# EAGLE design CORS_Rear_Panel (EAGLE 9.6.2)
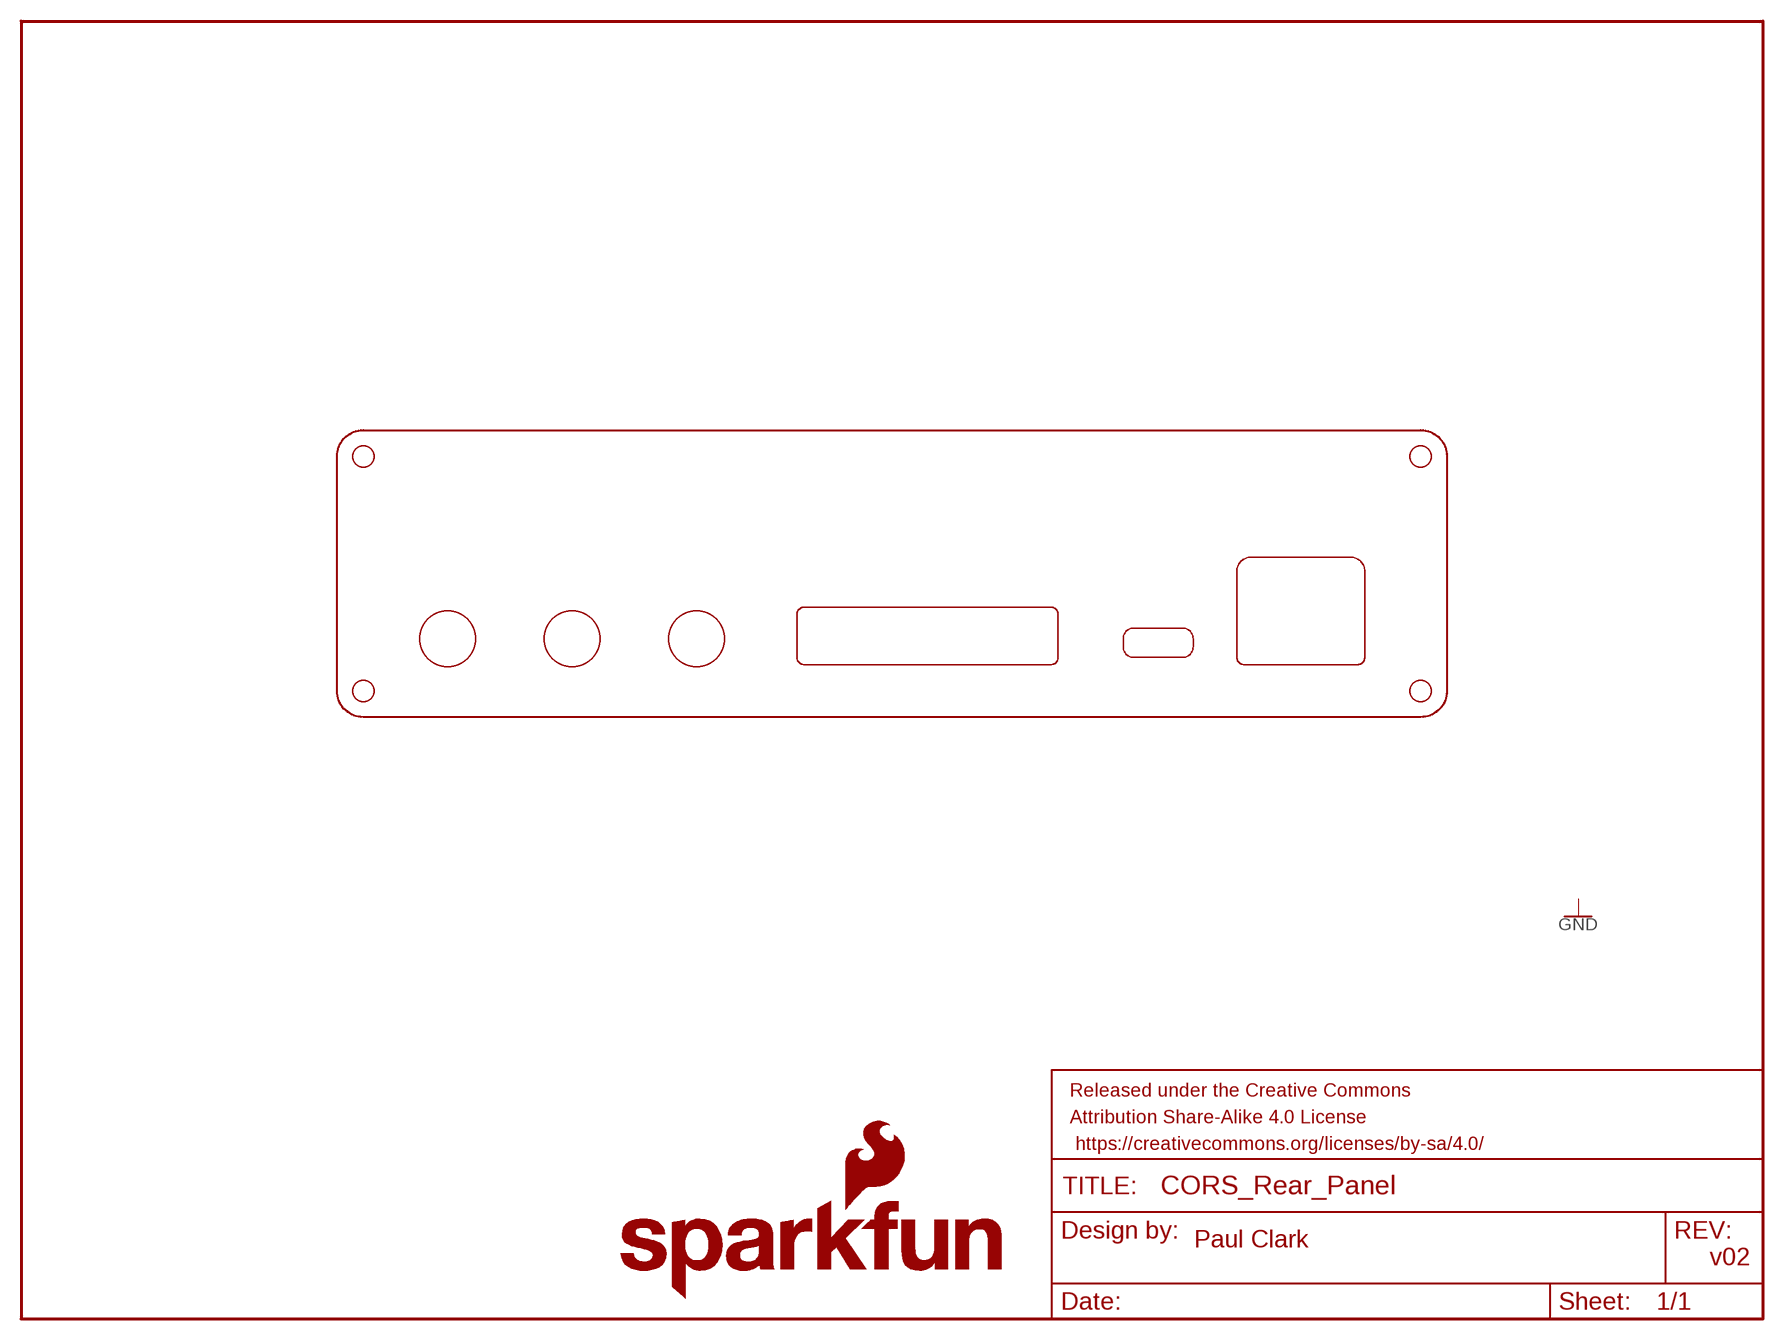
[diagram p0: schematic, sheet 1]

## Parts
ESP32_USB  USB-C  [USB-C]
FRAME1  FRAME-LETTER  [CREATIVE_COMMONS]
LOGO1  SFE_LOGO_NAME_FLAME.2_INCH  [SFE_LOGO_NAME_FLAME_.2]
PANEL_OUTLINE  PANEL_OUTLINE  [PANEL_OUTLINE]
U$8  3.5MM_CONNECTOR  [3.5MM_CONNECTOR]
U$13  SMA  [SMA]
U$14  SMA  [SMA]
U$15  SMA  [SMA]
U$25  ETHERNET  [ETHERNET]

## Notes on the sheet
- Paul Clark
- v02

## Library data of the parts
ESP32_USB = CORS_Panels:USB-C
FRAME1 = SparkFun-Aesthetics:FRAME-LETTER: Schematic Frame - Letter Standard 8.5x11 US Letter frame
LOGO1 = SparkFun-Aesthetics:SFE_LOGO_NAME_FLAME: SparkFun Font Logo w/ Flame This is the SparkFun full logo. The logo on the schematic will always be the same size; the package variant is the height of the flame part of the logo. Default layer for the logo on the board is tSilk.
PANEL_OUTLINE = CORS_Panels:PANEL_OUTLINE: Panel Outline Centered on the top surface of the PCB
U$8 = CORS_Panels:3.5MM_CONNECTOR
U$13-U$15 = CORS_Panels:SMA
U$25 = CORS_Panels:ETHERNET

## Board
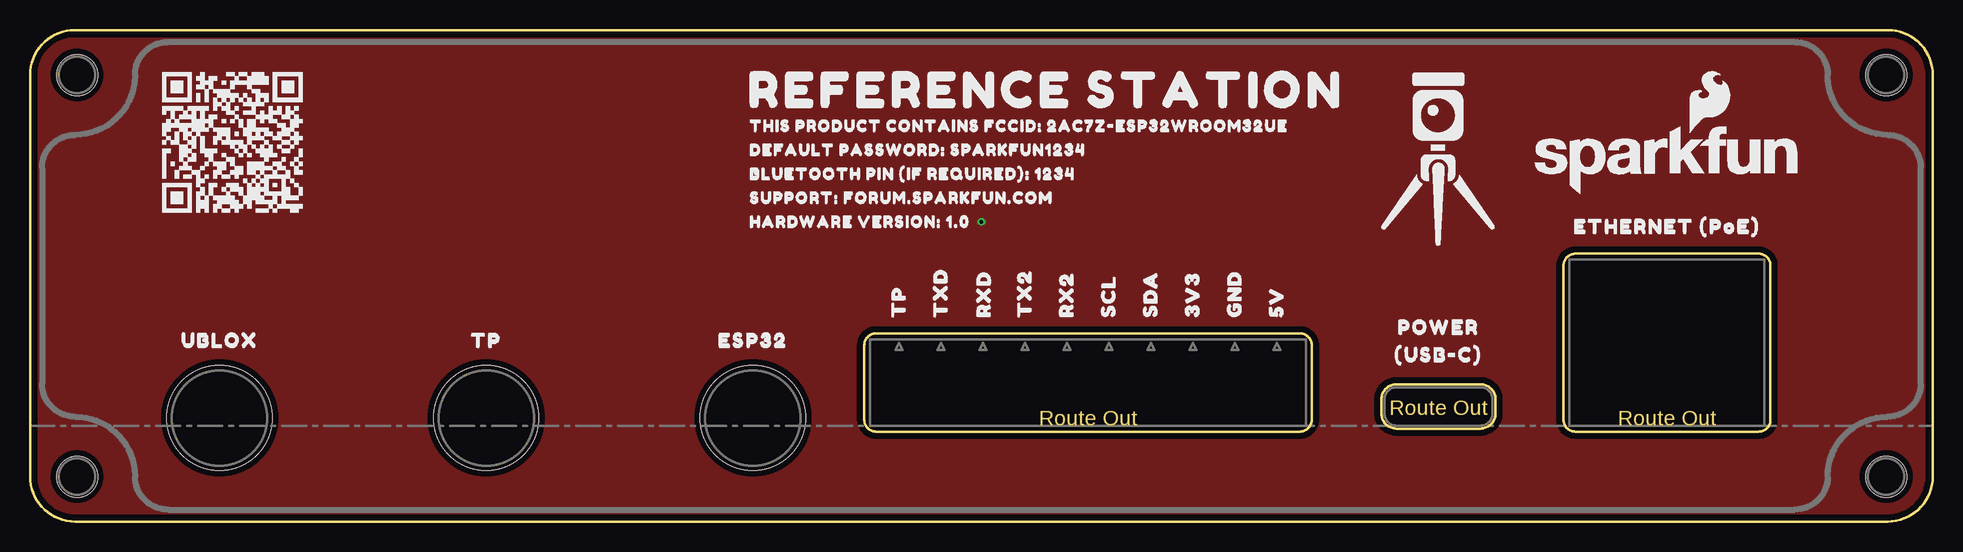
[diagram p1: board, top side]
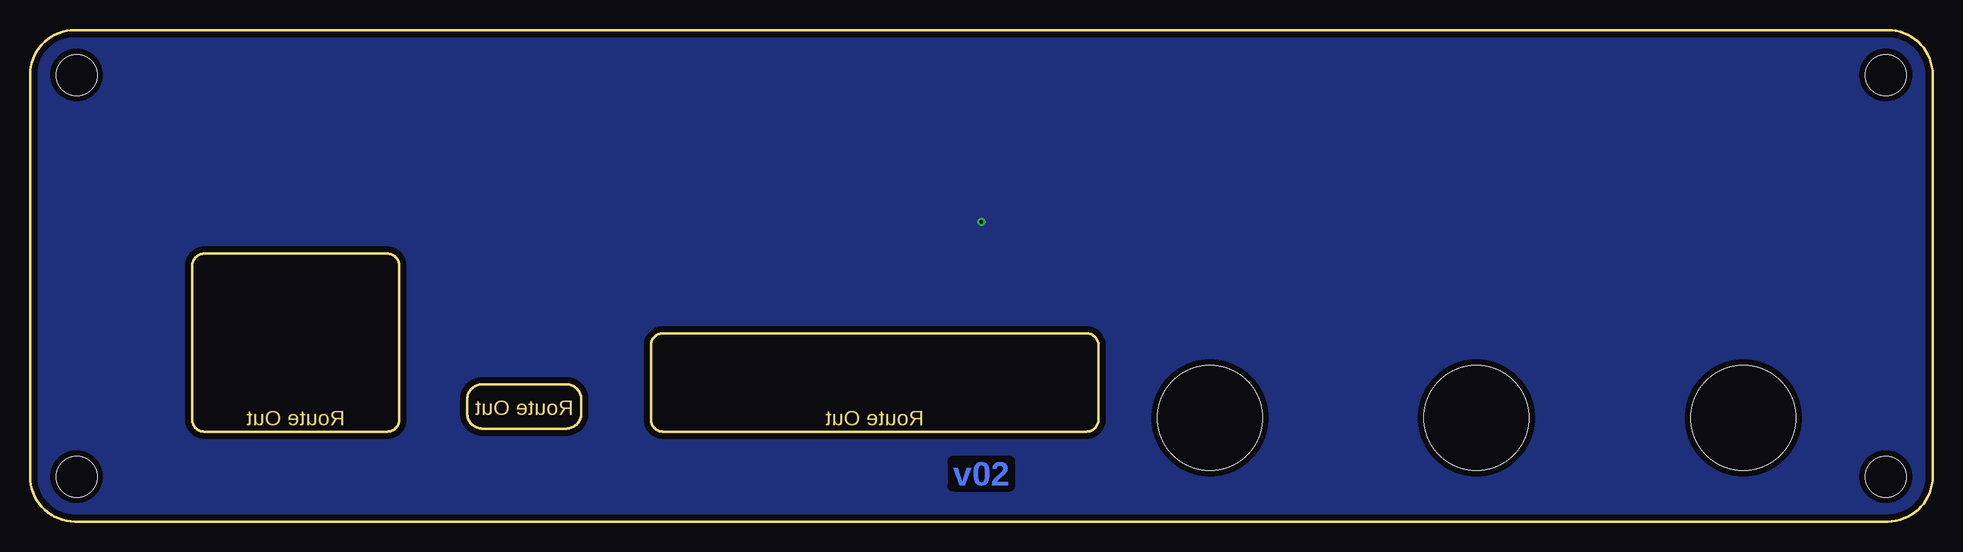
[diagram p2: board, bottom side, seen from below]

Size 158.6 x 41 mm. Coordinates in mm from the lower left corner, seen from the top.
Outline: 0,3.75 arc90 3.75,0 154.85,0 arc90 158.6,3.75 158.6,37.25 arc90 154.85,41 3.75,41 arc90 0,37.25 0,3.75
Copper layers (1*16): Top 0.035mm / dielectric 1.5mm / Bottom 0.035mm
Design rules "SparkFun-2-Layer-General-JLCPCB": minimum track width 7mil, minimum drill 0.3mm, track to track 7mil, track to pad 7mil, pad to pad 7mil, via to via 7mil, smd to smd 7mil, copper to edge 7mil, drill to drill 7mil, minimum pad ring 7mil, minimum via ring 7mil, stop-mask expansion 3mil, vias tented up to drill 25mil, thermal gap 10mil

### Footprints (pad centres in the part's own frame; a part is rotated, then mirrored left to right if it is on the bottom)
PANEL_OUTLINE = hole 3.4: -75.4,29.25; 75.4,29.25; 75.4,-4.25; -75.4,-4.25
SMA = hole 8.75: 0,0.635

### Placement (x,y rotation side)
ESP32_USB  117.4,8 0 top
FRAME1  60.25,-16.13 0 top  (outside the outline)
LOGO1  136.45,30.18 0 top
PANEL_OUTLINE  79.32,8 0 top
U$1  [REFERENCE_STATION0]  84.7,36 0 top
U$2  [THIS_PRODUCT_CONTAINS_FCCID#_2AC7Z#ESP32WROOM32UE0]  59.3,33 0 top
U$3  [BLUETOOTH_PIN_#IF_REQUIRED##_12340]  59.3,29 0 top
U$4  [SUPPORT#_FORUM#SPARKFUN#COM0]  59.3,27 0 top
U$5  [TP0]  72.4,16.2 90 top
U$6  [TXD1]  75.9,16.2 90 top
U$7  [HARDWARE_VERSION#_1#00]  59.3,25 0 top
U$8  88.19,8 0 top
U$9  [RXD2]  79.5,16.2 90 top
U$10  [TX23]  82.9,16.2 90 top
U$11  [RX224]  86.4,16.2 90 top
U$12  [SCL225]  89.9,16.2 90 top
U$13  15.8,8 0 top
U$14  38.02,8 0 top
U$15  60.25,8 0 top
U$16  [SDA226]  93.4,16.2 90 top
U$17  [3V3227]  96.9,16.2 90 top
U$18  [GND227]  100.4,16.2 90 top
U$19  [5V228]  103.9,16.2 90 top
U$20  [DEFAULT_PASSWORD#_SPARKFUN12340]  59.3,31 0 top
U$23  [UBLOX326]  15.8,15.1 0 top
U$25  136.45,8 0 top
U$28  [TP327]  38.02,15.1 0 top
U$29  [ESP324]  60.25,15.1 0 top
U$40  [POWER22335]  117.4,16.2 0 top
U$41  [_#USB#C#_22336]  117.4,13.9 0 top
U$42  [_ETHERNET_#POE#_22337]  136.45,24.6 0 top

### Tracks (layer width: path | path; a pad name or v marks a point on that pad's centre or on a via)
GND  (via drill 0.3)
  other vias: 79.3,25
  pour Top (isolate 0.5, no thermals): 0,41 158.6,41 158.6,0 0,0
  pour Bottom (isolate 0.5, no thermals): 0,41 158.6,41 158.6,0 0,0

### Text on the board
Bottom: v02
tDocu: Paul Clark